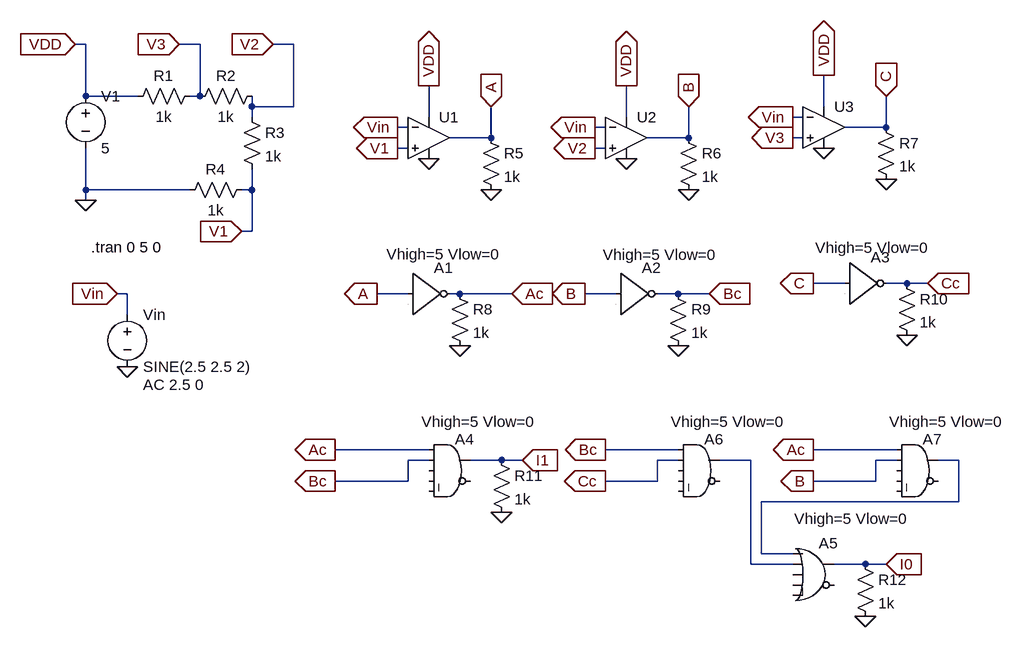
[diagram p0: schematic 2-bit ADC.asc]
2-bit ADC.asc, the LTspice schematic file:
Version 4.1
SHEET 1 1756 1140
WIRE -16 0 -32 0
WIRE 160 0 128 0
WIRE 304 0 272 0
WIRE -16 80 -16 0
WIRE 64 80 -16 80
WIRE 160 80 160 0
WIRE 160 80 144 80
WIRE 240 96 240 80
WIRE 304 96 304 0
WIRE 304 96 240 96
WIRE 1120 96 1120 48
WIRE 240 112 240 96
WIRE 512 112 512 64
WIRE 816 112 816 64
WIRE 1088 112 1072 112
WIRE 480 128 464 128
WIRE 784 128 768 128
WIRE 1216 128 1216 80
WIRE 1216 128 1152 128
WIRE 608 144 608 96
WIRE 608 144 544 144
WIRE 912 144 912 96
WIRE 912 144 848 144
WIRE 1088 144 1072 144
WIRE 480 160 464 160
WIRE 784 160 768 160
WIRE -16 224 -16 160
WIRE 144 224 -16 224
WIRE 240 224 240 192
WIRE 240 224 224 224
WIRE -16 240 -16 224
WIRE 240 288 240 224
WIRE 240 288 224 288
WIRE 1152 368 1104 368
WIRE 1248 368 1216 368
WIRE 1280 368 1248 368
WIRE 48 384 32 384
WIRE 480 384 432 384
WIRE 560 384 544 384
WIRE 640 384 560 384
WIRE 800 384 752 384
WIRE 896 384 864 384
WIRE 944 384 896 384
WIRE 48 416 48 384
WIRE 512 624 368 624
WIRE 896 624 784 624
WIRE 1232 624 1104 624
WIRE 512 640 480 640
WIRE 624 640 576 640
WIRE 656 640 624 640
WIRE 896 640 864 640
WIRE 1008 640 960 640
WIRE 1232 640 1200 640
WIRE 1328 640 1296 640
WIRE 480 672 480 640
WIRE 480 672 368 672
WIRE 864 672 864 640
WIRE 864 672 784 672
WIRE 1200 672 1200 640
WIRE 1200 672 1104 672
WIRE 1328 704 1328 640
WIRE 1328 704 1024 704
WIRE 1024 784 1024 704
WIRE 1072 784 1024 784
WIRE 1008 800 1008 640
WIRE 1072 800 1008 800
WIRE 1184 800 1136 800
WIRE 1216 800 1184 800
FLAG -16 240 0
FLAG -32 0 VDD
IOPIN -32 0 In
FLAG 128 0 V3
IOPIN 128 0 In
FLAG 272 0 V2
IOPIN 272 0 In
FLAG 224 288 V1
IOPIN 224 288 In
FLAG 1120 48 VDD
IOPIN 1120 48 Out
FLAG 1072 144 V3
IOPIN 1072 144 Out
FLAG 1216 208 0
FLAG 1120 160 0
FLAG 1072 112 Vin
IOPIN 1072 112 Out
FLAG 48 496 0
FLAG 32 384 Vin
IOPIN 32 384 In
FLAG 1216 80 C
IOPIN 1216 80 In
FLAG 512 64 VDD
IOPIN 512 64 Out
FLAG 464 160 V1
IOPIN 464 160 Out
FLAG 608 224 0
FLAG 512 176 0
FLAG 464 128 Vin
IOPIN 464 128 Out
FLAG 608 96 A
IOPIN 608 96 In
FLAG 816 64 VDD
IOPIN 816 64 Out
FLAG 768 160 V2
IOPIN 768 160 Out
FLAG 912 224 0
FLAG 816 176 0
FLAG 768 128 Vin
IOPIN 768 128 Out
FLAG 912 96 B
IOPIN 912 96 In
FLAG 432 384 A
IOPIN 432 384 Out
FLAG 752 384 B
IOPIN 752 384 Out
FLAG 1104 368 C
IOPIN 1104 368 Out
FLAG 560 464 0
FLAG 896 464 0
FLAG 1248 448 0
FLAG 640 384 Ac
IOPIN 640 384 In
FLAG 944 384 Bc
IOPIN 944 384 In
FLAG 1280 368 Cc
IOPIN 1280 368 In
FLAG 368 624 Ac
IOPIN 368 624 Out
FLAG 368 672 Bc
IOPIN 368 672 Out
FLAG 784 624 Bc
IOPIN 784 624 Out
FLAG 784 672 Cc
IOPIN 784 672 Out
FLAG 1104 624 Ac
IOPIN 1104 624 Out
FLAG 1104 672 B
IOPIN 1104 672 Out
FLAG 1184 880 0
FLAG 624 720 0
FLAG 656 640 I1
IOPIN 656 640 In
FLAG 1216 800 I0
IOPIN 1216 800 In
SYMBOL voltage -16 64 R0
WINDOW 123 0 0 Left 0
WINDOW 39 0 0 Left 0
SYMATTR InstName V1
SYMATTR Value 5
SYMBOL res 48 96 R270
WINDOW 0 32 56 VTop 2
WINDOW 3 0 56 VBottom 2
SYMATTR InstName R1
SYMATTR Value 1k
SYMBOL res 144 96 R270
WINDOW 0 32 56 VTop 2
WINDOW 3 0 56 VBottom 2
SYMATTR InstName R2
SYMATTR Value 1k
SYMBOL res 224 96 R0
SYMATTR InstName R3
SYMATTR Value 1k
SYMBOL res 240 208 R90
WINDOW 0 0 56 VBottom 2
WINDOW 3 32 56 VTop 2
SYMATTR InstName R4
SYMATTR Value 1k
SYMBOL res 1200 112 R0
SYMATTR InstName R7
SYMATTR Value 1k
SYMBOL voltage 48 400 R0
WINDOW 123 24 124 Left 2
WINDOW 39 0 0 Left 0
SYMATTR InstName Vin
SYMATTR Value SINE(2.5 2.5 2)
SYMATTR Value2 AC 2.5 0
SYMBOL OpAmps\\UniversalOpAmp2 1120 128 R0
SYMATTR InstName U3
SYMBOL res 592 128 R0
SYMATTR InstName R5
SYMATTR Value 1k
SYMBOL OpAmps\\UniversalOpAmp2 512 144 R0
SYMATTR InstName U1
SYMBOL res 896 128 R0
SYMATTR InstName R6
SYMATTR Value 1k
SYMBOL OpAmps\\UniversalOpAmp2 816 144 R0
SYMATTR InstName U2
SYMBOL Digital\\inv 480 320 R0
WINDOW 3 -33 3 Left 2
SYMATTR InstName A1
SYMATTR Value Vhigh=5 Vlow=0
SYMBOL Digital\\inv 800 320 R0
WINDOW 3 -20 4 Left 2
SYMATTR InstName A2
SYMATTR Value Vhigh=5 Vlow=0
SYMBOL Digital\\inv 1152 304 R0
WINDOW 3 -45 9 Left 2
SYMATTR InstName A3
SYMATTR Value Vhigh=5 Vlow=0
SYMBOL res 544 368 R0
SYMATTR InstName R8
SYMATTR Value 1k
SYMBOL res 880 368 R0
SYMATTR InstName R9
SYMATTR Value 1k
SYMBOL res 1232 352 R0
SYMATTR InstName R10
SYMATTR Value 1k
SYMBOL Digital\\and 544 592 R0
WINDOW 3 -43 -11 Left 2
SYMATTR InstName A4
SYMATTR Value Vhigh=5 Vlow=0
SYMBOL Digital\\or 1104 752 R0
WINDOW 3 -29 -22 Left 2
SYMATTR InstName A5
SYMATTR Value Vhigh=5 Vlow=0
SYMBOL Digital\\and 928 592 R0
WINDOW 3 -43 -11 Left 2
SYMATTR InstName A6
SYMATTR Value Vhigh=5 Vlow=0
SYMBOL Digital\\and 1264 592 R0
WINDOW 3 -43 -11 Left 2
SYMATTR InstName A7
SYMATTR Value Vhigh=5 Vlow=0
SYMBOL res 608 624 R0
SYMATTR InstName R11
SYMATTR Value 1k
SYMBOL res 1168 784 R0
SYMATTR InstName R12
SYMATTR Value 1k
TEXT -8 312 Left 2 !.tran 0 5 0

The netlist it stands for:
* 2-bit ADC.asc
V1 VDD 0 5
R1 VDD V3 1k
R2 V3 V2 1k
R3 V2 V1 1k
R4 V1 0 1k
R7 C 0 1k
Vin Vin 0 SINE(2.5 2.5 2) AC 2.5 0
X§U3 V3 Vin VDD 0 C level2 Avol=1Meg GBW=10Meg Slew=10Meg Ilimit=25m Rail=0 Vos=0 En=0 Enk=0 In=0 Ink=0 Rin=500Meg  ; pins In+ In- V+ V- OUT
R5 A 0 1k
X§U1 V1 Vin VDD 0 A level2 Avol=1Meg GBW=10Meg Slew=10Meg Ilimit=25m Rail=0 Vos=0 En=0 Enk=0 In=0 Ink=0 Rin=500Meg  ; pins In+ In- V+ V- OUT
R6 B 0 1k
X§U2 V2 Vin VDD 0 B level2 Avol=1Meg GBW=10Meg Slew=10Meg Ilimit=25m Rail=0 Vos=0 En=0 Enk=0 In=0 Ink=0 Rin=500Meg  ; pins In+ In- V+ V- OUT
A1 A 0 0 0 0 Ac 0 0 BUF Vhigh=5 Vlow=0
A2 B 0 0 0 0 Bc 0 0 BUF Vhigh=5 Vlow=0
A3 C 0 0 0 0 Cc 0 0 BUF Vhigh=5 Vlow=0
R8 Ac 0 1k
R9 Bc 0 1k
R10 Cc 0 1k
A4 Ac Bc 0 0 0 0 I1 0 AND Vhigh=5 Vlow=0
A5 N002 N001 0 0 0 0 I0 0 OR Vhigh=5 Vlow=0
A6 Bc Cc 0 0 0 0 N001 0 AND Vhigh=5 Vlow=0
A7 Ac B 0 0 0 0 N002 0 AND Vhigh=5 Vlow=0
R11 I1 0 1k
R12 I0 0 1k
.tran 0 5 0
.lib UniversalOpAmp2.lib
.backanno
.end